# Altium schematic sheet Weatstone Bridge Design.SchDoc: Weatstone Bridge Design
size A4; DocumentNumber: GPH-3110-4; Revision: 1; SheetNumber: 5; SheetTotal: 6; SPICEModelCacheOCUZZWQD: <root> / <DocumentId>OCUZZWQD</DocumentId> / <CacheFrame Number="0"> / <Model Name="nmos" Kind="MDL"> / <Text>*Default N-Channel MOSFET / *Pinout: D,G,S / .MODEL NMOS NMOS()</Text> / </Model> / </CacheFrame> / </root>
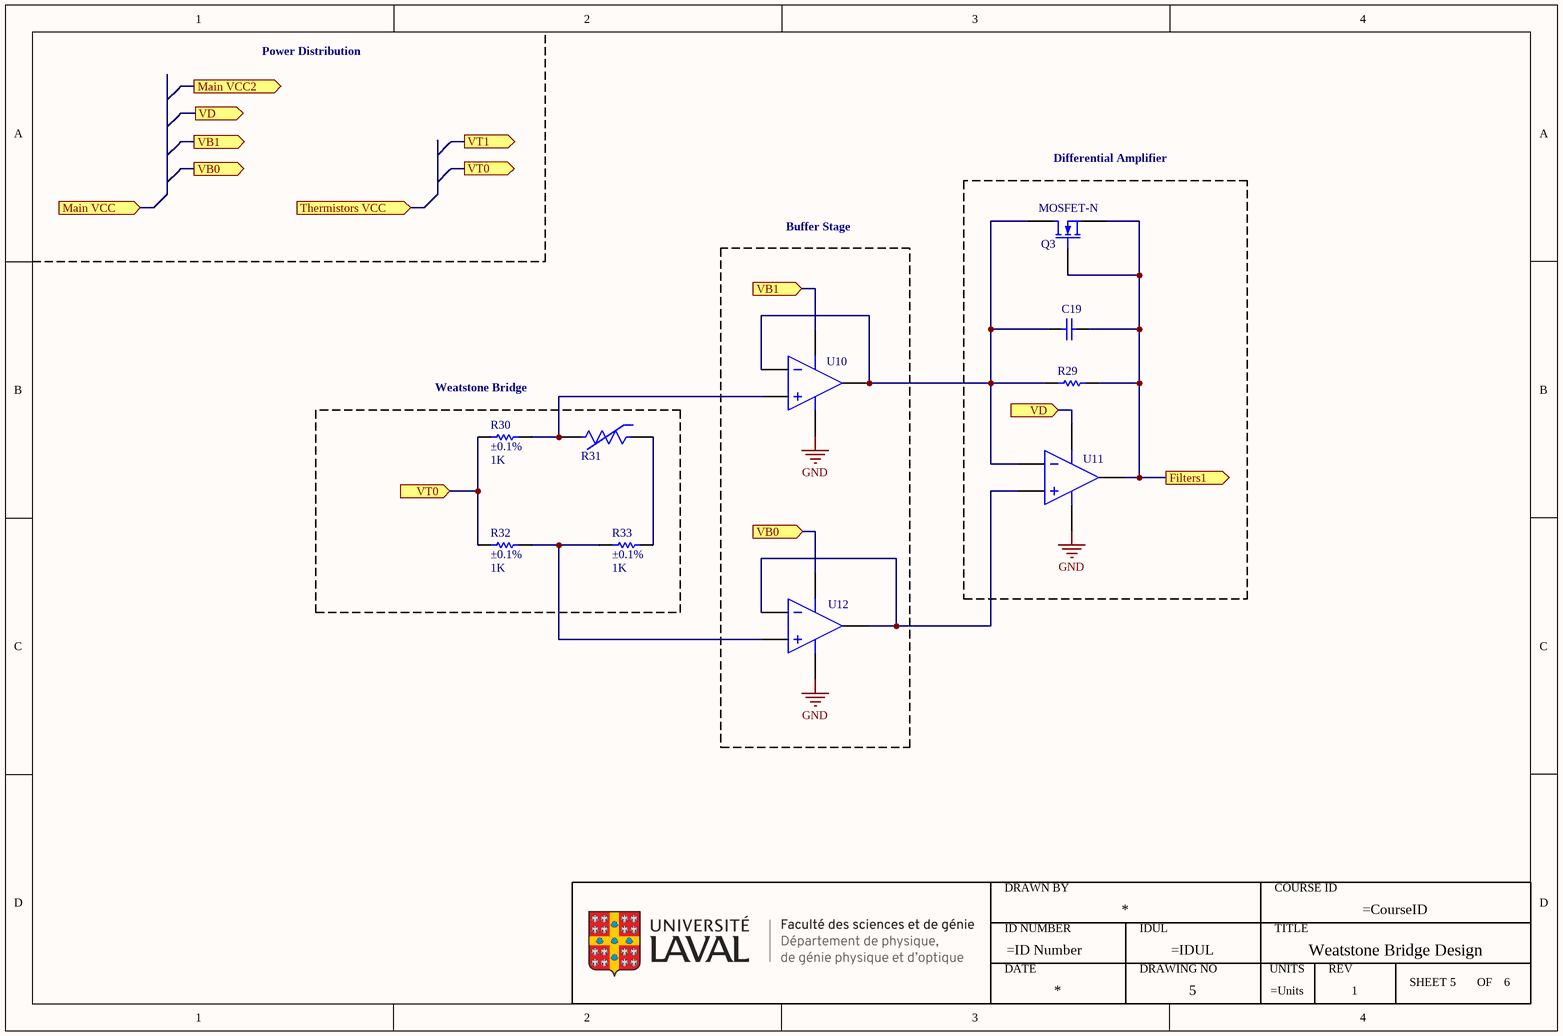
[diagram p0: Weatstone Bridge Design.SchDoc]

## Parts
*5  ULaval FSG-DPGPO  (value not drawn)
C19  Capacitor  (value not drawn)
Q3  MOSFET-N  [E3]
R29  Resistor  (value not drawn)
R30  value 1K  TC: ±0.1%  (hidden comment: Resistor)
R31  TMP6131DYAT  [FP-DYA0002A-MFG]  (value not drawn)
R32  value 1K  TC: ±0.1%  (hidden comment: Resistor)
R33  value 1K  TC: ±0.1%  (hidden comment: Resistor)
U10  Ideal Operational Amplifier  (value not drawn)
U11  Ideal Operational Amplifier  (value not drawn)
U12  Ideal Operational Amplifier  (value not drawn)

## Blocks framed on the sheet
Differential Amplifier: C19 Q3 R29 U11
Buffer Stage: U10 U12
Weatstone Bridge: R30-R33

## Ports
Filters1 (out), Main VCC2 (out), Main VCC (in), Thermistors VCC (in), VB0 (in), VB0 (out), VB1 (in), VB1 (out), VD (in), VD (out), VT0 (in), VT0 (out), VT1 (out)

## Nets
GND: U10.5(V-) U11.5(V-) U12.5(V-)
Filters1: C19.2 Q3.2(G) Q3.3(S) R29.2 U11.3(OUT) ; port Filters1
VB0: U12.4(V+) ; port VB0
VB1: U10.4(V+) ; port VB1
VD: U11.4(V+) ; port VD
VT0: R30.2 R32.2 ; port VT0
NetC19_1: C19.1 Q3.1(D)
NetR29_1: R29.1 U10.1(IN-) U10.3(OUT) U11.1(IN-)
NetR30_1: R30.1 R31.1(-) U10.2(IN+)
NetR31_2: R31.2(+) R33.1
NetR32_1: R32.1 R33.2 U12.2(IN+)
NetU11_2: U11.2(IN+) U12.1(IN-) U12.3(OUT)

## Notes on the sheet
- Power Distribution
- (in symbol ULaval FSG-DPGPO) DRAWN BY; COURSE ID; ID NUMBER; IDUL; TITLE; DATE; DRAWING NO; UNITS; REV; SHEET; OF

## Library data of the parts
C19 = Capacitor: SimulationGenericComponent: True; Value: 1p
Q3 = MOSFET-N: N-Channel MOSFET; Published: 8-Jun-2000; LatestRevisionDate: 17-Jul-2002; LatestRevisionNote: Re-released for DXP Platform.; PackageVersion: 1995/1996; PackageReference: E3; Publisher: Altium Limited; PackageDescription: TO, Flat Index; 3 In-Line, Axial Leads; Body Dia. 4.6mm; Lead Dia. 0.5 mm (max)
R29 = Resistor: TC1: 0; SimulationGenericComponent: True; Value: 1K; TC2: 0
R30 R32 R33 = Resistor: TC1: 0; SimulationGenericComponent: True; TC2: 0
R31 = CMP-009-00177-1: ±1% tolerance 10kΩ linear thermistor available in 0402 and 0603 package options 2-SOT-5X3 -40 to 125; Max Operating Temperature: 125°C; Mounting Technology: Surface Mount; Min Operating Temperature: -40°C; Series: -; Resistance Tolerance: 1%
U10-U12 = OpAmp with power terminals: SimulationGenericComponent: True; GAIN: 1Meg